# EAGLE design GrblPi B+Industrial (EAGLE 6.4)
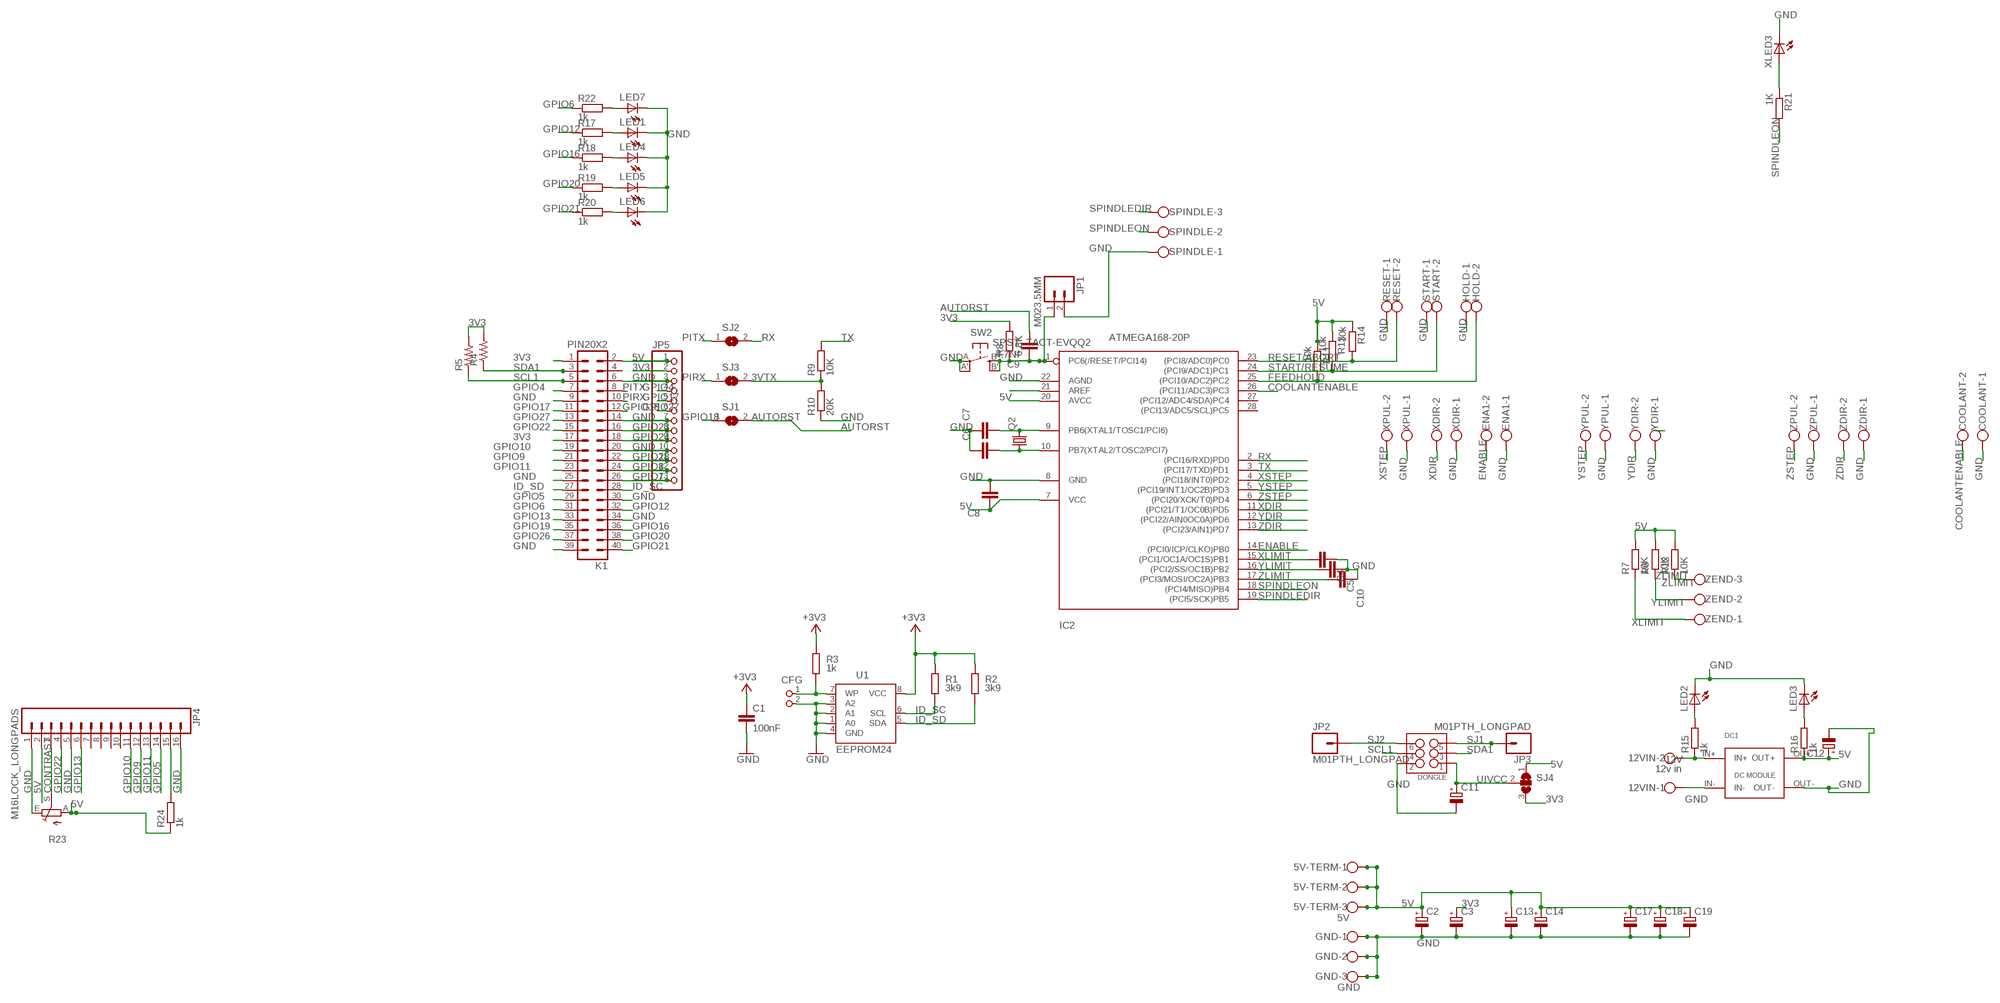
[diagram p0: schematic, sheet 1]

## Parts
5V-TERM  5V  W237-103  [W237-103]
12VIN  12v in  W237-102  [W237-102]
C1  100nF  C-EUC1206  [C1206]
C2  CPOL-EU153CLV-0405  [153CLV-0405]
C3  CPOL-EU153CLV-0405  [153CLV-0405]
C4  CAPACITOR_NPOL-1206  [C1206]
C5  CAPACITOR_NPOL-1206  [C1206]
C6  CAPACITOR_NPOL-1206  [C1206]
C7  CAPACITOR_NPOL-1206  [C1206]
C8  CAPACITOR_NPOL-1206  [C1206]
C9  4.7Nf  CAPACITOR_NPOL-1206  [C1206]
C10  CAPACITOR_NPOL-1206  [C1206]
C11  CPOL-EU153CLV-0405  [153CLV-0405]
C12  CPOL-EU153CLV-0405  [153CLV-0405]
C13  CPOL-EU153CLV-0405  [153CLV-0405]
C14  CPOL-EU153CLV-0405  [153CLV-0405]
C17  CPOL-EU153CLV-0405  [153CLV-0405]
C18  CPOL-EU153CLV-0405  [153CLV-0405]
C19  CPOL-EU153CLV-0405  [153CLV-0405]
CFG  PIN2_100  [PIN_W_2]
COOLANT  W237-102  [W237-102]
DC1  BUCKBOOST  [BUCKBOOST]
DONGLE  M03X2SHROUD  [2X3-SHROUDED]
ENA1  W237-102  [W237-102]
GND  GND  W237-103  [W237-103]
HOLD  W237-102  [W237-102]
IC2  ATMEGA168-20P  [DIL28-3]
JP1  M023.5MM  [SCREWTERMINAL-3.5MM-2]
JP2  M01PTH_LONGPAD  [1X01_LONGPAD]
JP3  M01PTH_LONGPAD  [1X01_LONGPAD]
JP4  M16LOCK_LONGPADS  [1X16_LOCK_LONGPADS]
JP5  PINHD-1X13  [1X13]
K1  PIN20X2  [PIN_20X2]
LED1  LED5MM  [LED5MM]
LED2  LED5MM  [LED5MM]
LED3  LED5MM  [LED5MM]
LED4  LED5MM  [LED5MM]
LED5  LED5MM  [LED5MM]
LED6  LED5MM  [LED5MM]
LED7  LED5MM  [LED5MM]
Q2  CRYSTALHC49UP  [HC49UP]
R1  3k9  R-EU_M1206  [M1206]
R2  3k9  R-EU_M1206  [M1206]
R3  1k  R-EU_M1206  [M1206]
R4  R-US_M1206  [M1206]
R5  R-US_M1206  [M1206]
R6  10K  RESISTOR-1206  [R1206]
R7  10K  RESISTOR-1206  [R1206]
R8  6.8K  RESISTOR-1206  [R1206]
R9  10K  RESISTOR-1206  [R1206]
R10  20K  RESISTOR-1206  [R1206]
R11  10k  RESISTOR-1206  [R1206]
R12  10K  RESISTOR-1206  [R1206]
R13  10k  RESISTOR-1206  [R1206]
R14  10k  RESISTOR-1206  [R1206]
R15  1k  RESISTOR-1206  [R1206]
R16  1k  RESISTOR-1206  [R1206]
R17  1k  RESISTOR-1206  [R1206]
R18  1k  RESISTOR-1206  [R1206]
R19  1k  RESISTOR-1206  [R1206]
R20  1k  RESISTOR-1206  [R1206]
R21  1K  RESISTOR-1206  [R1206]
R22  1k  RESISTOR-1206  [R1206]
R23  TRIM_EU-CA6V  [CA6V]
R24  1k  RESISTOR-1206  [R1206]
RESET  W237-102  [W237-102]
SJ1  SJ  [SJ]
SJ2  SJ  [SJ]
SJ3  SJ  [SJ]
SJ4  SJ2W  [SJ_2]
SPINDLE  W237-103  [W237-103]
START  W237-102  [W237-102]
SW2  SPST_TACT-EVQQ2  [EVQ-Q2]
U1  EEPROM24  [SOIC8]
XDIR  W237-102  [W237-102]
XLED3  LEDCHIPLED_1206  [CHIPLED_1206]
XPUL  W237-102  [W237-102]
YDIR  W237-102  [W237-102]
YPUL  W237-102  [W237-102]
ZDIR  W237-102  [W237-102]
ZEND  W237-103  [W237-103]
ZPUL  W237-102  [W237-102]

## Nets
3V3: C3.+ JP5.2 K1.1 K1.17 R4.2 R5.2 R8.2 SJ4.3
3VTX: R9.1 R10.2 SJ3.2
5V: 5V-TERM.1 5V-TERM.2 5V-TERM.3 C2.+ C8.1 C12.+ C13.+ C14.+ C17.+ C18.+ C19.+ DC1.OU+(OUT+) IC2.7(VCC) IC2.20(AVCC) JP4.2 JP5.1 K1.2 R6.2 R7.2 R11.1 R12.2 R13.1 R14.1 R16.1 R23.A R24.1 SJ4.1
12V: 12VIN.2 DC1.IN+ R15.1
+3V3: C1.1 R1.2 R2.2 R3.2 U1.8(VCC)
AUTORST: C9.2 SJ1.2
CONTRAST: JP4.3 R23.S
COOLANTENABLE: COOLANT.2 IC2.26((PCI11/ADC3)PC3)
ENABLE: ENA1.2 IC2.14((PCI0/ICP/CLKO)PB0)
FEEDHOLD: HOLD.2 IC2.25((PCI10/ADC2)PC2) R11.2
GND: 12VIN.1 C1.2 C2.- C3.- C4.1 C5.1 C6.1 C7.1 C8.2 C10.1 C11.- C12.- C13.- C14.- C17.- C18.- C19.- CFG.2 COOLANT.1 DC1.IN- DC1.OUT- DONGLE.2 ENA1.1 GND.1 GND.2 GND.3 HOLD.1 IC2.8(GND) IC2.22(AGND) JP1.2 JP4.1 JP4.5 JP4.16 JP5.3 JP5.7 JP5.10 K1.6 K1.9 K1.14 K1.20 K1.25 K1.30 K1.34 K1.39 LED1.K(C) LED2.K(C) LED3.K(C) LED4.K(C) LED5.K(C) LED6.K(C) LED7.K(C) R10.1 R23.E RESET.1 SPINDLE.1 START.1 SW2.A'(P1) SW2.A(P) U1.1(A0) U1.2(A1) U1.3(A2) U1.4(GND) XDIR.1 XLED3.C XPUL.1 YDIR.1 YPUL.1 ZDIR.1 ZPUL.1
GPIO4: JP5.4 K1.7
GPIO5: JP4.14 K1.29
GPIO6: K1.31 R22.1
GPIO7: JP5.13 K1.26
GPIO8: JP5.12 K1.24
GPIO9: JP4.12 K1.21
GPIO10: JP4.11 K1.19
GPIO11: JP4.13 K1.23
GPIO12: K1.32 R17.1
GPIO13: JP4.6 K1.33
GPIO16: K1.36 R18.1
GPIO17: JP5.5 K1.11
GPIO18: K1.12 SJ1.1
GPIO19: K1.35
GPIO20: K1.38 R19.1
GPIO21: K1.40 R20.1
GPIO22: JP4.4 K1.15
GPIO23: JP5.8 K1.16
GPIO24: JP5.9 K1.18
GPIO26: K1.37
GPIO27: JP5.6 K1.13
GPIO28: JP5.11 K1.22
ID_SC: K1.28 R1.1 U1.6(SCL)
ID_SD: K1.27 R2.1 U1.5(SDA)
LED: JP4.15 R24.2
MCURESET1: C9.1 IC2.1(PC6(/RESET/PCI14)) JP1.1 R8.1 SW2.B'(S1) SW2.B(S)
N$3: CFG.1 R3.1 U1.7(WP)
N$5: LED2.A R15.2
N$6: LED3.A R16.2
N$7: LED1.A R17.2
N$8: LED4.A R18.2
N$9: LED5.A R19.2
N$10: LED6.A R20.2
N$11: LED7.A R22.2
N$13: IC2.21(AREF)
PIRX: K1.10 SJ3.1
PITX: K1.8 SJ2.1
RESET/ABORT: IC2.23((PCI8/ADC0)PC0) R14.2 RESET.2
RX: IC2.2((PCI16/RXD)PD0) SJ2.2
SCL1: DONGLE.4 K1.5 R5.1
SDA1: DONGLE.3 K1.3 R4.1
SJ1: DONGLE.5 JP3.1
SJ2: DONGLE.6 JP2.1
SPINDLEDIR: IC2.19((PCI5/SCK)PB5) SPINDLE.3
SPINDLEON: IC2.18((PCI4/MISO)PB4) R21.2 SPINDLE.2
START/RESUME: IC2.24((PCI9/ADC1)PC1) R13.2 START.2
TX: IC2.3((PCI17/TXD)PD1) R9.2
UIVCC: C11.+ DONGLE.1 SJ4.2
XDIR: IC2.11((PCI21/T1/OC0B)PD5) XDIR.2
XLIMIT: C4.2 IC2.15((PCI1/OC1A/OC1S)PB1) R7.1 ZEND.1
XSTEP: IC2.4((PCI18/INT0)PD2) XPUL.2
XTAL3: C6.2 IC2.10(PB7(XTAL2/TOSC2/PCI7)) Q2.1
XTAL4: C7.2 IC2.9(PB6(XTAL1/TOSC1/PCI6)) Q2.2
YDIR: IC2.12((PCI22/AIN0OC0A)PD6) YDIR.2
YLIMIT: C5.2 IC2.16((PCI2/SS/OC1B)PB2) R6.1 ZEND.2
YSTEP: IC2.5((PCI19/INT1/OC2B)PD3) YPUL.2
ZDIR: IC2.13((PCI23/AIN1)PD7) ZDIR.2
ZLED3: R21.1 XLED3.A
ZLIMIT: C10.2 IC2.17((PCI3/MOSI/OC2A)PB3) R12.1 ZEND.3
ZSTEP: IC2.6((PCI20/XCK/T0)PD4) ZPUL.2
Unconnected: IC2.27((PCI12/ADC4/SDA)PC4) IC2.28((PCI13/ADC5/SCL)PC5) JP4.7 JP4.8 JP4.9 JP4.10 K1.4

## Library data of the parts
5V-TERM GND SPINDLE ZEND = con-wago-500:W237-103: WAGO SCREW CLAMP; MPN: 237-103; OC_FARNELL: unknown; OC_NEWARK: 18M7116
12VIN COOLANT ENA1 HOLD RESET START XDIR XPUL YDIR YPUL ZDIR ZPUL = con-wago-500:W237-102: WAGO SCREW CLAMP; MPN: 237-102; OC_FARNELL: unknown; OC_NEWARK: 70K9898
C1 = resistor:C-EU: CAPACITOR, European symbol; DIELECTRIC: X7R
C2 C3 C11-C14 C17-C19 = rcl:CPOL-EU: POLARIZED CAPACITOR, European symbol
C4-C10 = dp_devices:CAPACITOR_NPOL: Non-Polarized capacitor in various packages
CFG = FLYFISH:PIN2
DC1 = OpenHardware.co.za:BUCKBOOST: Ebay-style LM2596 Buck/Boost Switchmode Convert modules
DONGLE = SparkFun-Connectors:M03X2: 2x3 .1" header. Shrouded, with keying- CONN-10681 SMT- CONN-11415 Pogo pins- HW-11044; PROD_ID: CONN-10681
IC2 = adafruit:ATMEGA168*P: MICROCONTROLLER 16 kBytes FLASH 1 kBytes SRAM 512 Bytes EEPROM USART 8-channel 10 bit ADC
JP1 = SparkFun-Connectors:M02: Standard 2-pin 0.1" header. Use with - straight break away headers ( PRT-00116) - right angle break away headers (PRT-00553) - swiss pins (PRT-00743) - machine pins (PRT-00117) - female headers (PRT-00115) Molex polarized connector foot print use with: PRT-08233 with associated crimp pins and housings. 2.54_SCREWTERM for use with PRT-10571. 3.5mm Screw Terminal footprints for PRT-08084 5mm Screw Terminal footprints for use with PRT-08433
JP2 JP3 = SparkFun-Connectors:M01: Header 1 Standard 1-pin 0.1" header. Use with straight break away headers (SKU : PRT-00116), right angle break away headers (PRT-00553), swiss pins (PRT-00743), machine pins (PRT-00117), and female headers (PRT-00115).
JP4 = SparkFun-Connectors:M16: 1x16 .1" header
JP5 = adafruit:PINHD-1X13: PIN HEADER
K1 = FLYFISH:PIN20X2
LED1-LED7 XLED3 = adafruit:LED: LED OSRAM: - CHIPLED LG R971, LG N971, LY N971, LG Q971, LY Q971, LO R971, LY R971 LH N974, LH R974 LS Q976, LO Q976, LY Q976 LO Q996 - Hyper CHIPLED LW Q18S LB Q993, LB Q99A, LB R99A - SideLED LS A670, LO A670, LY A670, LG A670, LP A670 LB A673, LV A673, LT A673, LW A673 LH A674 LY A675 LS A676, LA A676, LO A676, LY A676, LW A676 LS A679, LY A679, LG A679 - Hyper Micro SIDELED® LS Y876, LA Y876, LO Y876, LY Y876 LT Y87S - SmartLED LW L88C, LW L88S LB L89C, LB L89S, LG L890 LS L89K, LO L89K, LY L89K LS L896, LA L896, LO L896, LY L896 - TOPLED LS T670, LO T670, LY T670, LG T670, LP T670 LSG T670, LSP T670, LSY T670, LOP T670, LYG T670 LG T671, LOG T671, LSG T671 LB T673, LV T673, LT T673, LW T673 LH T674 LS T676, LA T676, LO T676, LY T676, LB T676, LH T676, LSB T676, LW T676 LB T67C, LV T67C, LT T67C, LS T67K, LO T67K, LY T67K, LW E67C LS E67B, LA E67B, LO E67B, LY E67B, LB E67C, LV E67C, LT E67C LW T67C LS T679, LY T679, LG T679 LS T770, LO T770, LY T770, LG T770, LP T770 LB T773, LV T773, LT T773, LW T773 LH T774 LS E675, LA E675, LY E675, LS T675 LS T776, LA T776, LO T776, LY T776, LB T776 LHGB T686 LT T68C, LB T68C - Hyper Mini TOPLED® LB M676 - Mini TOPLED Santana® LG M470 LS M47K, LO M47K, LY M47K Source: http://www.osram.convergy.de/
Q2 = adafruit:CRYSTAL: CRYSTAL; OC_FARNELL: unknown; OC_NEWARK: unknown
R1-R3 = resistor:R-EU_: RESISTOR, European symbol; TOLERANCE: 5%
R4 R5 = adafruit:R-US_: RESISTOR, American symbol
R6-R22 R24 = dp_devices:RESISTOR
R23 = pot:TRIM_EU-: POTENTIOMETER
SJ1-SJ3 = jumper:SJ: SMD solder JUMPER
SJ4 = jumper:SJ2W: SMD solder JUMPER
SW2 = adafruit:SPST_TACT: SMT 6mm switch, EVQQ2 series http://www.ladyada.net/library/eagle
U1 = FLYFISH:EEPROM24

## Board
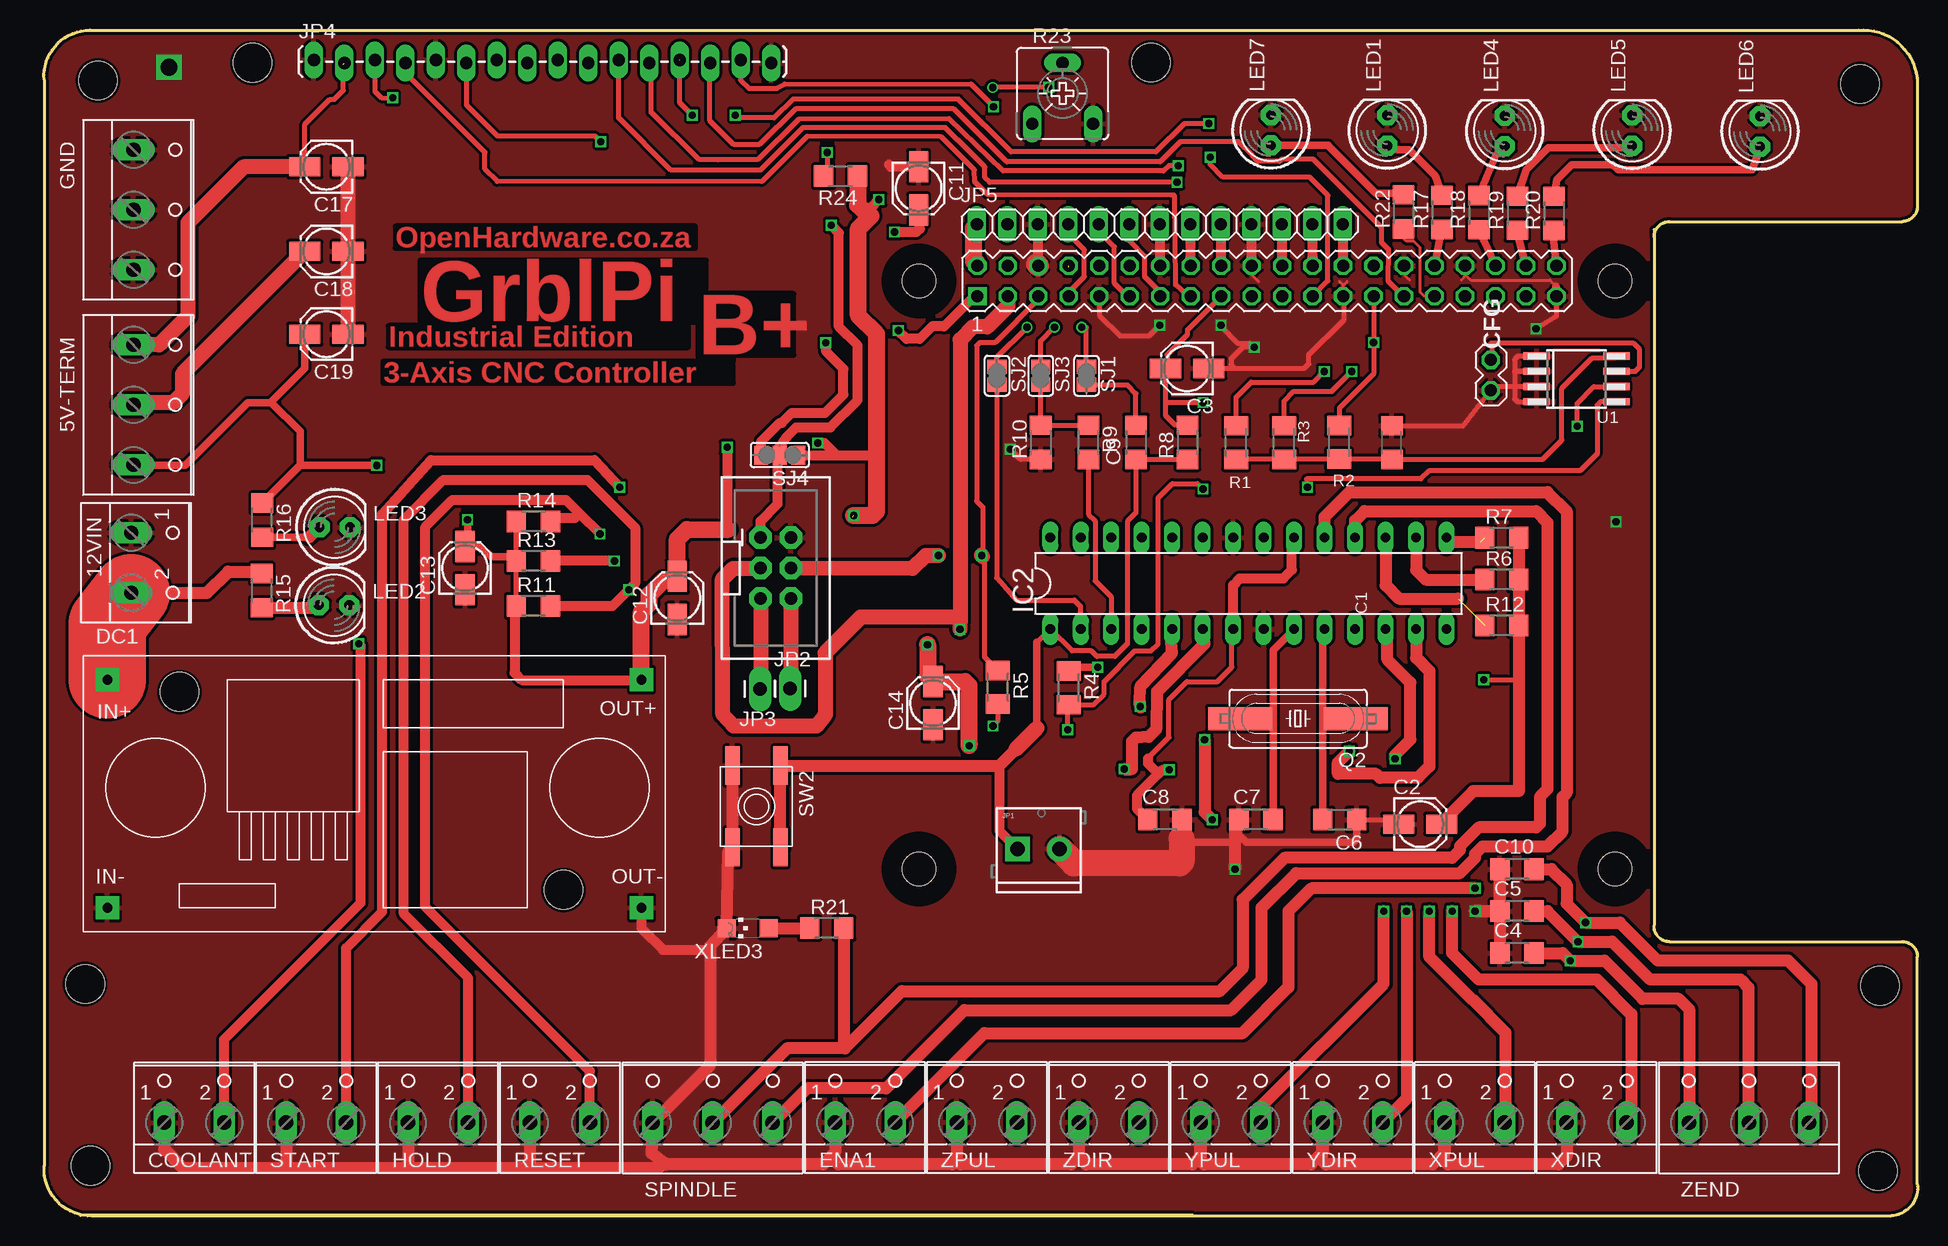
[diagram p1: board, top side]
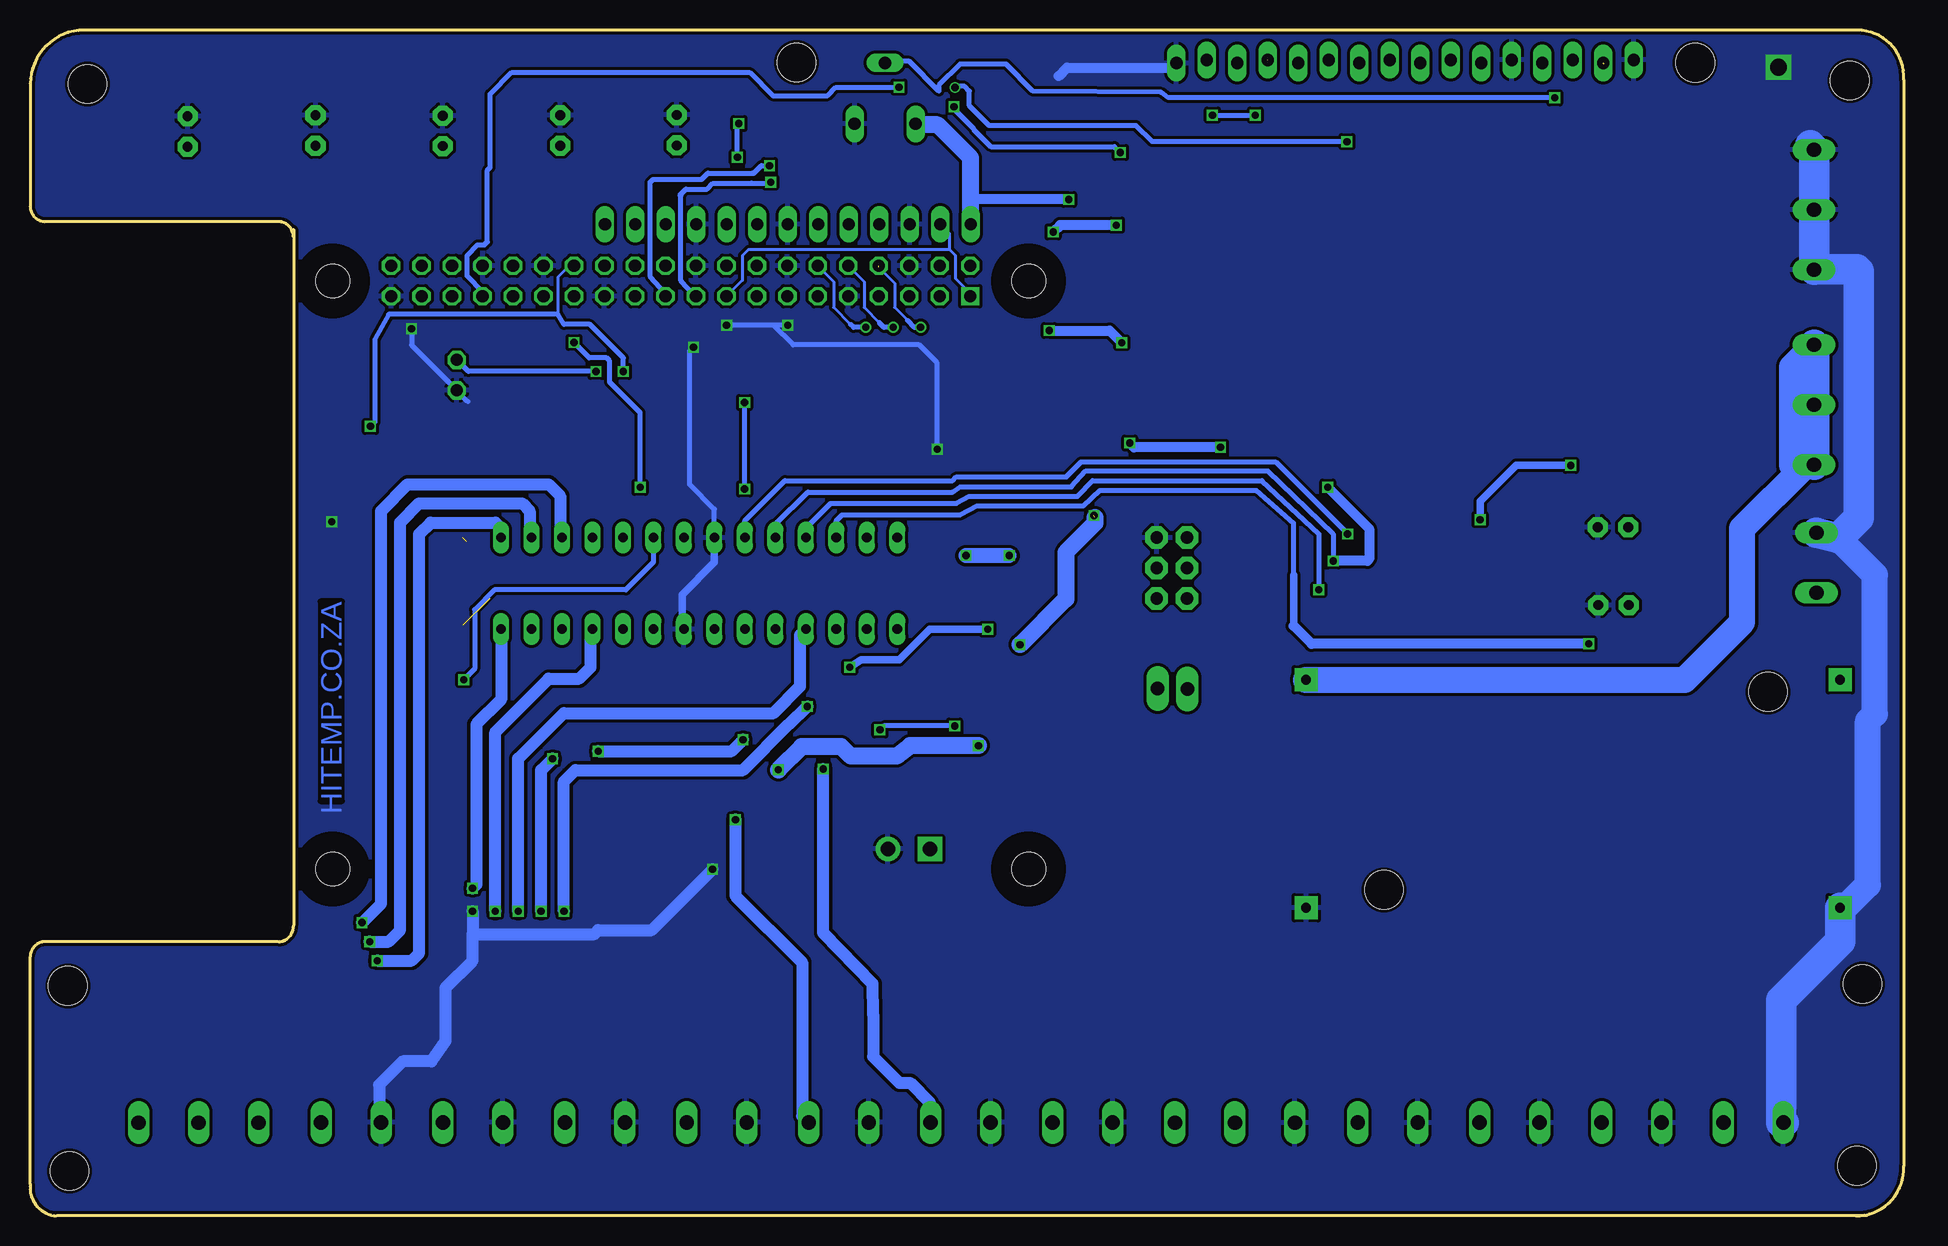
[diagram p2: board, bottom side, seen from below]

Size 156.14 x 98.83 mm. Coordinates in mm from the lower left corner, seen from the top.
Outline: 0.01,94.69 0.01,4.15 arc94 4.02,0 153.93,0 arc94 156.12,2.66
Outline: 156.12,2.64 156.12,21.59 arc90 154.85,22.86 135.46,22.86 arc-90 134.19,24.13
Outline: 134.18,82.22 134.18,24.22
Outline: 134.19,81.6 arc-90 135.46,82.87 154.85,82.87 arc90 156.12,84.14 156.12,94.37 arc94 151.21,98.81 3.84,98.81 arc94 0.01,94.7
Outline: 95.76,0.05 3.05,0.05
Copper layers (1*16): Top 0.035mm / dielectric 1.5mm / Bottom 0.035mm
Design rules "dirt_cheap_dirty_boards.v1 *": minimum track width 5mil, minimum drill 12mil, track to track 10mil, track to pad 10mil, pad to pad 10mil, via to via 10mil, smd to smd 10mil, copper to edge 10mil, drill to drill 10mil, minimum pad ring 10mil, minimum via ring 6mil, stop-mask expansion 2mil, vias tented up to drill 25mil, thermal gap 10mil
Holes 2.8 mm at 72.92,28.91 72.92,77.91 130.92,77.91 130.92,28.91
Holes 3.2 mm at 3.89,4.18 152.84,3.73 152.99,19.18 3.44,19.33 4.49,94.63 151.34,94.33 17.37,96.1 92.27,96.11
tRestrict: area 71.4,76.4 to 74.5,79.5; area 129.4,76.4 to 132.5,79.5; area 129.4,27.4 to 132.5,30.5; area 71.4,27.4 to 74.5,30.5
bRestrict: area 71.4,27.4 to 74.5,30.5; area 71.4,76.4 to 74.5,79.5; area 129.4,27.4 to 132.5,30.5; area 129.4,76.4 to 132.5,79.5

### Footprints (pad centres in the part's own frame; a part is rotated, then mirrored left to right if it is on the bottom)
W237-103 = drill 1.194 long: 1 -5,-1.29; 2 0,-1.29; 3 5,-1.29
W237-102 = drill 1.194 long: 1 -2.5,-1.27; 2 2.5,-1.27
C1206 = smd 1.6 x 1.8: 1 -1.4,0; 2 1.4,0
153CLV-0405 = smd 2.6 x 1.6: + 1.8,0; - -1.8,0
C1206' = smd 1.6 x 1.803: 1 -1.422,0; 2 1.422,0
PIN_W_2 = drill 1.016 octagon: 1 0,0; 2 0,-2.54
BUCKBOOST = drill 0.8 pad 1.93 square: IN+ 2,21; IN- 2,2; OU+ 46.5,21; OUT- 46.5,2 | hole 3.2: 8,20; 40,3.5
2X3-SHROUDED = drill 1.016 pad 1.88 octagon: 1 -1.27,2.54; 2 1.27,2.54; 3 -1.27,0; 4 1.27,0; 5 -1.27,-2.54; 6 1.27,-2.54
DIL28-3 = drill 0.813 long: 1 -16.51,-3.81; 2 -13.97,-3.81; 3 -11.43,-3.81; 4 -8.89,-3.81; 5 -6.35,-3.81; 6 -3.81,-3.81; 7 -1.27,-3.81; 8 1.27,-3.81; 9 3.81,-3.81; 10 6.35,-3.81; 11 8.89,-3.81; 12 11.43,-3.81; 13 13.97,-3.81; 14 16.51,-3.81; 15 16.51,3.81; 16 13.97,3.81; 17 11.43,3.81; 18 8.89,3.81; 19 6.35,3.81; 20 3.81,3.81; 21 1.27,3.81; 22 -1.27,3.81; 23 -3.81,3.81; 24 -6.35,3.81; 25 -8.89,3.81; 26 -11.43,3.81; 27 -13.97,3.81; 28 -16.51,3.81
SCREWTERMINAL-3.5MM-2 = drill 1.2 pad 2.032 square: 1 0,0 | drill 1.2 pad 2.032: 2 3.5,0
1X01_LONGPAD = drill 1.118 pad 1.88 long: 1 0,0
1X16_LOCK_LONGPADS = drill 1.016 long: 1 0,0.127; 2 2.54,-0.127; 3 5.08,0.127; 4 7.62,-0.127; 5 10.16,0.127; 6 12.7,-0.127; 7 15.24,0.127; 8 17.78,-0.127; 9 20.32,0.127; 10 22.86,-0.127; 11 25.4,0.127; 12 27.94,-0.127; 13 30.48,0.127; 14 33.02,-0.127; 15 35.56,0.127; 16 38.1,-0.127
1X13 = drill 1.016 long: 1 -15.24,0; 2 -12.7,0; 3 -10.16,0; 4 -7.62,0; 5 -5.08,0; 6 -2.54,0; 7 0,0; 8 2.54,0; 9 5.08,0; 10 7.62,0; 11 10.16,0; 12 12.7,0; 13 15.24,0
PIN_20X2 = drill 1.016 square: 1 -24.13,-1.27 | drill 1.016 octagon: 2 -24.13,1.27; 3 -21.59,-1.27; 4 -21.59,1.27; 5 -19.05,-1.27; 6 -19.05,1.27; 7 -16.51,-1.27; 8 -16.51,1.27; 9 -13.97,-1.27; 10 -13.97,1.27; 11 -11.43,-1.27; 12 -11.43,1.27; 13 -8.89,-1.27; 14 -8.89,1.27; 15 -6.35,-1.27; 16 -6.35,1.27; 17 -3.81,-1.27; 18 -3.81,1.27; 19 -1.27,-1.27; 20 -1.27,1.27; 21 1.27,-1.27; 22 1.27,1.27; 23 3.81,-1.27; 24 3.81,1.27; 25 6.35,-1.27; 26 6.35,1.27; 27 8.89,-1.27; 28 8.89,1.27; 29 11.43,-1.27; 30 11.43,1.27; 31 13.97,-1.27; 32 13.97,1.27; 33 16.51,-1.27; 34 16.51,1.27; 35 19.05,-1.27; 36 19.05,1.27; 37 21.59,-1.27; 38 21.59,1.27; 39 24.13,-1.27; 40 24.13,1.27
LED5MM = drill 0.813 pad 1.676 octagon: A -1.27,0; K 1.27,0
HC49UP = smd 5.334 x 1.93: 1 -4.826,0; 2 4.826,0
M1206 = smd 1.6 x 2: 1 -1.4,0; 2 1.4,0
R1206 = smd 1.6 x 1.803: 1 -1.422,0; 2 1.422,0
CA6V = drill 1.016 long: A -2.54,-2.54; E 2.54,-2.54; S 0,2.54
SJ = smd 1.168 x 1.6: 1 -0.762,0; 2 0.762,0
SJ_2 = smd 1.168 x 1.6: 1 -1.524,0; 2 0,0; 3 1.524,0
EVQ-Q2 = smd 3.2 x 1.2: A -3.4,-2; A' 3.4,-2; B -3.4,2; B' 3.4,2
SOIC8 = smd 0.6 x 2.2: 1 -1.905,-3.33; 2 -0.635,-3.33; 3 0.635,-3.33; 4 1.905,-3.33; 5 1.905,3.33; 6 0.635,3.33; 7 -0.635,3.33; 8 -1.905,3.33
CHIPLED_1206 = smd 1.5 x 1.5: A 0,-1.75; C 0,1.75

### Placement (x,y rotation side)
5V-TERM  8.75,67.59 270 top
12VIN  8.54,54.43 270 top
C1  112.32,64.44 90 top
C2  114.69,32.65 0 top
C3  95.26,70.62 180 top
C4  [C1206']  122.76,21.91 0 top
C5  [C1206']  122.76,25.4 0 top
C6  [C1206']  107.99,33.03 180 top
C7  [C1206']  101.01,33.03 0 top
C8  [C1206']  93.42,33.03 0 top
C9  4.7Nf  [C1206']  91.01,64.47 90 top
C10  [C1206']  122.76,28.89 0 top
C11  72.89,85.63 270 top
C12  52.78,51.5 90 top
C13  35.09,53.98 90 top
C14  74.09,42.73 90 top
C17  23.54,87.43 180 top
C18  23.54,80.38 180 top
C19  23.54,73.48 180 top
CFG  120.58,71.34 0 top
COOLANT  12.52,9.05 0 top
DC1  3.29,23.68 0 top
DONGLE  60.99,54 0 top
ENA1  68.43,9.06 0 top
GND  8.75,83.85 270 top
HOLD  32.84,9.05 0 top
IC2  100.37,52.72 0 top
JP1  81.14,30.58 0 top
JP2  62.18,43.95 0 top
JP3  59.68,43.91 180 top
JP4  22.51,96.2 0 top
JP5  92.99,82.63 0 top
K1  101.92,77.91 0 top
LED1  111.95,90.46 90 top
LED2  24.17,50.9 0 top
LED3  24.23,57.4 0 top
LED4  121.74,90.42 90 top
LED5  132.34,90.44 90 top
LED6  143.01,90.38 90 top
LED7  102.25,90.48 90 top
Q2  104.5,41.45 180 top
R1  99.34,64.45 270 top
R2  107.93,64.47 270 top
R3  103.34,64.45 270 top
R4  85.39,44.01 270 top
R5  79.49,44.06 270 top
R6  121.49,53.02 0 top
R7  121.49,56.52 0 top
R8  95.29,64.47 90 top
R9  87.04,64.47 270 top
R10  83.07,64.47 90 top
R11  40.79,50.83 0 top
R12  121.49,49.21 0 top
R13  40.79,54.58 0 top
R14  40.79,57.88 0 top
R15  18.16,52.11 270 top
R16  18.19,57.99 270 top
R17  116.52,83.63 90 top
R18  119.58,83.61 90 top
R19  122.79,83.55 90 top
R20  125.85,83.54 90 top
R21  65.24,23.98 0 top
R22  113.31,83.67 90 top
R23  84.89,93.54 0 top
R24  66.38,86.65 180 top
RESET  43,9.05 0 top
SJ1  86.88,70.02 270 top
SJ2  79.42,70.02 270 top
SJ3  83.07,70.02 270 top
SJ4  61.32,63.4 180 top
SPINDLE  55.73,9.06 0 top
START  22.68,9.05 0 top
SW2  59.38,34.12 270 top
U1  127.72,69.75 270 top
XDIR  129.39,9.06 0 top
XLED3  58.64,23.98 90 top
XPUL  119.23,9.06 0 top
YDIR  109.07,9.06 0 top
YPUL  98.91,9.06 0 top
ZDIR  88.75,9.06 0 top
ZEND  142.09,9.06 0 top
ZPUL  78.59,9.06 0 top

### Tracks (layer width: path | path; a pad name or v marks a point on that pad's centre or on a via)
3V3  (via drill 0.6, 0.6 pad 0.41)
  Top 0.406: K1.17 95.29,73.83 95.29,73.45 93.61,71.77 93.61,70.77 C3.+ 93.46,67.78 | 93.46,67.78 93.46,66.71 94.24,65.93 95.25,65.93 R8.2 | v85.31,40.5 85.31,42.53 R4.2 87.46,42.61 88.34,43.48 88.34,44.53 90.89,47.08 92.24,47.08 92.84,47.68 92.84,59.83 94.04,61.03 96.14,61.03 v96.59,60.58 | R5.2 79.49,41.23 v79.08,40.83 | v96.59,67.78 93.46,67.78
  Top 0.813: SJ4.3 59.79,64.56 61.32,66.09 61.5,66.09 62.33,66.93 65.1,66.93 66.62,68.45 66.62,70.59 | 66.62,70.59 66.61,70.54 | K1.1 77.51,76.64 75.01,74.14 74.01,74.14 72.96,73.09 71.9,73.09 v71.21,73.78 | v65.16,72.77 65.16,72.06 66.62,70.59
  Bottom 0.254: K1.1 77.79,76.9 79,78.12 79,80.02 79.51,80.53 | 79.51,80.53 96.28,80.53 96.78,80.02 96.78,77.96 K1.17 | 79.51,80.53 79.51,81.84 arc-45 79.52,81.86 JP5.2
  Bottom 0.406: 79.23,40.88 78.96,40.83 v79.08,40.83 84.99,40.83 v85.31,40.5 | v96.59,60.58 v96.59,67.78
  Bottom 0.813: v71.21,73.78 66.17,73.78 v65.16,72.77
3VTX
  Top 0.406: SJ3.2 R10.2 R9.1
5V  (via drill 0.6, 0.6 pad 0.41)  (2 unrouted)
  Top 0.406: 92,38.14 93.74,39.88 93.74,43.03 95.24,44.53 97.79,44.53 98.99,45.73 98.99,48.8 IC2.7 | v119.99,44.68 122.61,44.68 122.91,44.38 | 39.22,50.98 R11.1 R13.1 R14.1 | C17.+ 21.74,90.96 23.82,93.04 24.2,93.04 24.96,93.8 24.96,95.99
  Top 0.61: 18.88,67.78 18.95,67.78 21.35,65.38 21.35,62.57 R16.1 21.31,62.54 v27.74,62.54 | v35.3,58.03 35.3,55.99 C13.+ 36.42,55.78 37.28,54.92 39.03,54.92 R13.1 | C19.+ 21.74,70.64 18.88,67.78 | 18.88,67.78 16.99,67.78 11.78,62.57 7.48,62.57 5V-TERM.3
  Top 0.813: 77.45,82.33 JP5.1 | v93.78,37.18 93.21,37.18 92.87,36.84 | 92.87,36.84 91.07,35.04 91.07,33.96 C8.1 | 92,38.14 92,37.71 92.87,36.84 | IC2.7 99.1,52.58 99.65,53.12 103.28,53.12 104,53.83 104,56.34 IC2.20 | SJ4.1 66.06,63.4 | 66.06,63.4 69.15,63.4 69.39,63.16 | 56.98,57.2 56.98,64.01 v56.93,64.05 | v64.49,64.41 65.05,64.41 66.06,63.4 | 68.93,83.34 68.93,84.07 v69.58,84.71 | 39.22,50.98 39.22,45.25 39.82,44.65 49.93,44.65 49.98,44.7
  Top 1.016: R7.2 R6.2 R12.2 122.91,44.38 122.91,35.39 119.1,35.39 116.41,32.7 116.54,32.7 C2.+
  Top 1.27: K1.2 77.79,79.54 | C17.+ 16.64,87.43 11.99,82.78 11.99,74.98 9.59,72.58 7.47,72.58 5V-TERM.1 | C18.+ 11.54,70.18 11.54,68.53 10.79,67.78 7.65,67.78 5V-TERM.2
  Top 1.422: 56.98,57.2 53.6,57.22 52.78,56.39 C12.+ 52.45,52.97 51.64,52.97 50.44,51.77 50.44,51.01 49.79,50.35 DC1.OU+ | v73.64,47.61 73.64,44.99 C14.+ 76.77,44.53 77.08,44.22 77.08,39.52 v77.1,39.18 | v67.48,58.37 69.05,58.37 69.39,58.71 69.39,63.16 69.39,73.51 67.87,75.04 67.87,82.28 68.93,83.34 68.72,83.34 67.81,84.26 R24.1 | 77.45,82.33 77.45,79.52 K1.2
  Bottom 0.406: IC2.20 104.18,54.49 106.49,52.18 117.44,52.18 119.09,50.53 119.09,45.58 v119.99,44.68
  Bottom 0.61: v27.74,62.54 32.29,62.54 35.27,59.57 35.27,58.06 v35.3,58.03
  Bottom 0.813: v56.93,64.05 64.14,64.05 v64.49,64.41 | v69.58,84.71 77.67,84.71 77.75,84.79
  Bottom 1.422: 67.4,58.21 67.4,57.73 69.82,55.31 69.82,51.43 v73.64,47.61 | JP5.1 77.75,84.79 77.75,88.17 80.51,90.93 82.27,90.93 R23.A | v77.1,39.18 82.8,39.18 83.92,38.32 87.74,38.32 88.54,39.12 91.84,39.12 v93.78,37.18
  Bottom 2.184: DC1.OU+ 18.25,44.68 13.45,49.48 13.45,57.29 8.17,62.57 9.29,62.57 9.29,70.77 5V-TERM.1
  Bottom 2.54: 5V-TERM.1 5V-TERM.2 | 5V-TERM.2 7.46,67.51 7.79,67.18 | 7.79,67.18 7.79,67.26 5V-TERM.2 | 5V-TERM.3 7.46,66.85 7.79,67.18
12V
  Top 1.016: 12VIN.2 13.58,51.93 15.35,53.7 17.98,53.7 R15.1
  Top 6.452: DC1.IN+ 5.29,49.35 12VIN.2
+3V3
  Top 0.406: R1.2 R3.2 103.37,63.07 R2.2 107.96,63.04 C1.1 124.89,63.04 126.5,64.66 126.5,68.97 129.04,71.51 130.91,71.51 U1.8
AUTORST
  Top 0.406: C9.2 91.01,68.53 90.31,69.23 86.91,69.23 SJ1.2
CONTRAST  (via drill 0.6 pad 0.41)
  Top 0.406: JP4.3 27.58,93.71 28.11,93.18 28.71,93.16 v29.07,93.17
  Bottom 0.406: v29.07,93.17 61.27,93.19 61.88,93.63 72.57,93.74 74.81,95.98 78.63,95.98 80.39,94.21 80.39,93.74 82.86,96.21 84.76,96.21 R23.S
COOLANTENABLE  (via drill 0.6 pad 0.41)
  Top 0.813: COOLANT.2 15.02,14.71 26.39,26.08 26.39,47.53 v26.24,47.68
  Bottom 0.406: IC2.26 88.94,57.94 88.47,58.42 78.62,58.42 77.2,59.18 68.38,59.18 66.99,60.47 53.94,60.47 50.84,57.73 50.84,53.38
  Bottom 0.61: 50.84,49.18 50.84,53.38
  Bottom 0.813: v26.24,47.68 49.34,47.68 50.84,49.18
ENABLE  (via drill 0.6)
  Top 1.016: v119.26,27.3 105.61,27.3 103.71,25.4 103.71,19.05 99.9,15.24 78.38,15.24 ENA1.2
  Bottom 1.016: IC2.14 116.88,43.02 118.95,40.96 118.95,27.62 v119.26,27.3
FEEDHOLD  (via drill 0.6 pad 0.41)
  Top 0.406: v48.74,52.18 48.74,52.03 47.54,50.83
  Top 0.813: HOLD.2 35.34,19.83 29.99,25.18 29.99,58.03 33.29,61.33 45.29,61.33 49.27,57.36 49.27,52.71 v48.74,52.18 47.39,50.83 R11.2
  Bottom 0.406: IC2.25 91.48,57.31 89.42,59.37 78.94,59.37 77.89,59.97 68.85,59.97 67.59,61.28 53.49,61.28 48.74,56.83 v48.74,52.18
GND  (via drill 0.6, 1.4 pad 0.41)
  Top 0.254: K1.20 100.65,78.45 101.23,77.86 | 107.96,77.86 108.21,77.61 108.21,76.69 K1.25 108.27,77.53 108.59,77.86 | K1.30 113.35,78.45 113.8,77.99 | 118.12,77.99 118.5,78.37 118.5,79.11 K1.34 118.43,78.45 118.88,77.99 125.49,77.99 125.99,77.48
  Top 0.406: 122.57,69.12 U1.3 122.96,69.12 122.57,69.1 122.57,68.08 122.82,67.83 124.38,67.83 U1.4 | 122.57,69.12 120.89,69.12 CFG.2 118.26,65.84 C1.2 | U1.1 122.83,71.65 122.57,71.39 122.57,70.37 | 122.57,70.37 124.38,70.37 U1.2 122.96,70.39 122.57,70.37 | 122.57,70.37 122.57,69.12 | K1.39 126.05,74.99 v124.34,73.93 | C3.- 99.26,70.62 | 99.26,70.62 105.04,70.62 105.42,71.01 105.42,71.77 108.34,74.69 108.34,76.57 K1.25 | C6.1 112.51,33.03 C2.- | v100.85,72.39 99.9,72.39 98.94,71.44 98.94,70.94 99.26,70.62 | K1.9 87.95,75.08 89.69,73.33 92.09,73.33 v92.99,74.23 | v98.09,74.23 98.09,74.08 99.44,72.73 100.49,72.73 100.79,72.43 | R10.1 81.38,63.04 v80.54,63.88
  Top 0.61: C6.1 109.41,31.44 109.1,31.13 100.21,31.13 99.58,31.76 C7.1 99.58,31.77 98.94,31.13 95.13,31.13 94.82,31.45 94.82,33.01 C8.2 | K1.39 126.05,77.43 125.99,77.48
  Top 0.813: DC1.OUT- 49.79,23.98 51.59,22.18 55.38,22.18 55.53,22.33 | JP5.7 92.99,79.22 K1.14 | JP5.10 100.61,79.22 K1.20 | JP5.3 82.83,79.22 K1.6 | C11.- 70.6,87.43 70.42,87.6
  Top 1.016: 76.05,4.61 76.09,4.65 ZPUL.1 | XDIR.1 126.89,4.97 126.21,4.29 117,4.29 116.69,4.61 116.69,7.75 XPUL.1 116.73,5.29 115.73,4.29 106.84,4.29 106.53,4.61 106.53,7.75 YDIR.1 106.57,5.29 105.57,4.29 96.68,4.29 96.37,4.61 96.37,7.75 YPUL.1 96.41,4.97 95.73,4.29 86.84,4.29 86.25,4.89 ZDIR.1 86.25,4.97 85.57,4.29 76.36,4.29 76.05,4.61 | 76.05,4.61 75.73,4.29 66.2,4.29 65.89,4.61 | 65.89,7.75 ENA1.1 65.93,5.29 64.93,4.29 51.86,4.29 51.67,4.44 | 51.67,4.44 50.65,5.21 50.8,7.54 SPINDLE.1 | 50.5,7.24 SPINDLE.1 | C5.1 v119.26,25.4 121.49,25.4 121.33,25.55 C10.1 C5.1 | C5.1 C4.1 | v99.26,28.89 99.26,32.71 C7.1 | 57.44,37.59 SW2.A SW2.A' 57.04,30.39 XLED3.C 55.53,22.47 55.53,22.33 55.53,12.57 SPINDLE.1 | COOLANT.1 10.02,5.55 11.54,4.03 20.09,4.03 | 20.09,4.03 30.59,4.03 | 30.59,4.03 40.64,4.03 | 40.64,4.03 51.26,4.03 51.67,4.44 | START.1 20.18,4.12 20.09,4.03 | HOLD.1 30.34,4.28 30.59,4.03 | RESET.1 40.5,4.17 40.64,4.03
  Top 1.27: C19.- C18.- C17.-
  Top 1.778: 82.75,79.3 K1.6
  Top 2.184: 94.82,31.45 94.82,29.56 94.64,29.38 85.84,29.38 JP1.2
  Bottom 0.406: 119.64,67.86 CFG.2 124.34,72.56 v124.34,73.93 | IC2.22 99.1,58.9 101.17,60.96 101.17,72.07 v100.85,72.39 | v92.99,74.23 94.19,74.23 | 94.19,74.23 v98.09,74.23 | v80.54,63.88 80.54,71.08 82.04,72.58 92.54,72.58 94.19,74.23
  Bottom 0.61: IC2.22 99.1,54.46 101.8,51.77 101.8,49.07 IC2.8
  Bottom 0.813: 70.42,94.99 69.73,95.68 61,95.68 JP4.16
  Bottom 1.016: 119.26,23.49 119.26,21.27 121.53,19.01 121.53,14.57 122.69,12.88 125.09,12.88 127.04,10.93 127.04,7.94 XDIR.1 | v119.26,25.4 119.26,23.49 | 119.26,23.49 109.1,23.49 108.79,23.81 104.34,23.81 v99.26,28.89
  Bottom 2.184: DC1.IN- 4.89,25.68 2.99,27.58 2.99,41.23 2.39,41.83 2.39,53.43 5.44,56.48
  Bottom 2.54: 12VIN.1 5.44,56.48 3.74,58.18 3.74,78.73 3.89,78.88 7.43,78.88 GND.3 GND.2 GND.1 | GND.1 7.46,88.9 7.79,89.23 7.79,89.18 GND.1 | DC1.IN- 5.29,22.88 10.19,17.98 10.19,7.78 COOLANT.1
  other vias: 10.43,95.73 131.01,57.86
  pour Top: -7.81,101.08 155.39,101.08 159.89,96.58 159.89,82.63 156.59,79.33 139.79,79.33 137.24,76.78 137.24,27.88 139.04,26.08 157.04,26.08 159.59,23.53 159.59,-0.17 155.84,-3.92 -0.16,-3.92 -5.86,1.78 -5.86,99.13
  pour Bottom: -3.16,102.58 150.84,101.72 160.19,98.38 160.19,81.88 157.79,79.48 138.89,79.48 137.09,77.68 137.09,26.08 137.99,25.18 156.29,25.18 158.69,22.78 158.69,0.13 155.09,-3.47 -2.11,-3.47 -5.86,0.28 -5.86,99.88
GPIO4
  Top 0.406: K1.7 85.41,76.98 86.7,78.28 86.7,80.51 85.3,81.91 85.3,82.57 JP5.4
GPIO5
  Top 0.406: K1.29 113.28,76.64 arc-45 113.27,76.65 112.03,77.88 112.06,80.51 arc45 112.02,80.56 111.48,81.11 111.48,82.34 arc45 111.47,82.36 109.14,84.69 arc45 109.14,84.69 105.76,88.07 103.17,88.07 arc45 103.15,88.07 102.97,87.89 101.18,87.89 arc-45 101.16,87.9 100.72,88.34 100.72,88.35 99.55,89.53 94.7,89.53 93.02,87.84 80.24,87.84 75.82,92.26 62.64,92.26 59.6,89.27 59.35,89.27 59.14,89.27 57.5,89.27 55.49,91.28 55.49,96.04 JP4.14
GPIO6
  Top 0.254: K1.31 115.04,76.64 arc-45 115.03,76.65 114.68,76.99 114.68,80.68 arc45 114.68,80.69 114.14,81.23 113.56,81.23 arc-45 113.54,81.24 113.29,81.5 113.29,82.22 arc-45 113.29,82.24 R22.1
GPIO7
  Top 0.813: JP5.13 108.23,79.22 K1.26
GPIO8
  Top 0.813: JP5.12 105.69,79.22 K1.24
GPIO9  (via drill 0.6 pad 0.41)
  Top 0.406: v94.52,87.53 93.76,87.53 93.31,87.08 79.91,87.08 75.41,91.43 62.9,91.38 59.47,88.02 57.69,88.02 57.39,88.02 56.14,88.02 56.2,88.03 54.61,88.03 50.6,91.97 50.6,95.92 JP4.12
  Bottom 0.406: K1.21 103.19,76.89 arc-45 103.19,76.91 104.44,78.26 104.44,86.13 arc45 104.49,86.09 104.21,86.37 100.19,86.37 arc-45 100.18,86.38 99.66,86.9 95.93,86.9 arc45 95.92,86.89 | 95.92,86.89 95.91,86.88 | 95.92,86.89 95.83,86.89 95.19,87.53 v94.52,87.53
GPIO10  (via drill 0.6 pad 0.41)
  Top 0.406: v94.42,86.14 78.82,86.14 78.42,86.54 78.42,87.42 76.2,89.64 76.17,89.64 75.12,90.69 63.24,90.69 59.7,87.14 52.25,87.14 47.89,91.5 47.89,96.32 JP4.11
  Bottom 0.406: K1.19 100.69,76.64 arc45 100.71,76.65 101.89,77.94 101.89,85.03 arc45 101.99,85.05 101.47,85.56 99.72,85.56 arc-45 99.71,85.57 99.23,86.04 96.06,86.04 arc-45 96.04,86.05 | 96.04,86.05 96.02,86.07 | 96.04,86.05 94.51,86.05 v94.42,86.14
GPIO11  (via drill 0.6 pad 0.41)  (1 unrouted)
  Top 0.406: K1.23 105.73,76.66 107,77.93 107,85.05 105.48,86.57 98.24,86.57 97.19,87.62 v97.19,88.22 | v97.07,91.04 95.03,91.04 92.66,88.67 80.6,88.67 76.2,93.07 62.42,93.07 60.85,91.5 57.71,91.5 57.6,91.61 v57.6,91.73 v57.61,91.73 | v54.03,91.73 52.98,92.79 JP4.13
  Bottom 0.406: v97.19,88.22 97.19,90.91 v97.07,91.04 | v57.61,91.73 v54.03,91.73
GPIO12
  Top 0.61: K1.32 116.45,82.14 R17.1
GPIO13  (via drill 0.6 pad 0.41)
  Top 0.406: v83.72,94.07 79.42,94.07 79.38,94.03 v79.06,94.04 | JP4.6 35.2,92.6 37.79,90.01 45.91,90.01 v46.4,89.52
  Bottom 0.406: K1.33 118.43,77 119.72,78.34 119.72,80 118.84,80.93 118.27,80.93 118.03,81.17 118.03,87.14 117.79,87.38 117.79,93.48 115.98,95.29 96.18,95.29 94.26,93.37 89.68,93.37 88.99,94.06 83.73,94.06 v83.72,94.07 | v46.4,89.52 62.63,89.52 63.98,90.87 76.21,90.87 77.87,92.52 77.87,93.73 78.26,94.13 78.96,94.13 v79.06,94.04
GPIO16
  Top 0.61: K1.36 119.57,82.18 R18.1
GPIO17
  Top 0.406: K1.11 90.29,76.64 89.2,77.73 89.2,80.78 87.9,82.09 87.9,82.62 JP5.5
GPIO18  (via drill 0.6)
  Top 0.406: SJ1.1 86.88,74.05 v86.5,74.05
  Top 0.813: 90.45,79.22 K1.12
  Bottom 0.254: K1.12 89.16,77.86 89.16,75.7 87.77,74.31
  Bottom 0.406: v86.5,74.05 87.51,74.05 87.77,74.31
GPIO20
  Top 0.61: K1.38 122.75,82.1 R19.1
GPIO21
  Top 0.61: K1.40 125.75,82.02 R20.1
GPIO22
  Top 0.406: K1.15 95.37,76.64 arc-45 95.36,76.65 94.32,77.59 94.21,84.94 arc45 94.16,85.06 93.94,85.07 78.74,85.1 arc-45 78.62,85.15 77.58,86.17 77.54,87.18 74.79,89.92 63.61,89.96 59.8,86.2 37.76,86.21 arc-45 37.76,86.21 36.74,87.23 36.74,88.61 arc-45 36.75,88.63 | 36.75,88.63 36.77,88.65 | JP4.4 30.12,95.25 36.75,88.63
GPIO23
  Top 0.813: JP5.8 95.53,79.22 K1.16
GPIO24
  Top 0.813: JP5.9 98.07,79.22 K1.18
GPIO27
  Top 0.406: K1.13 93.03,76.97 91.74,78.25 91.74,79.99 90.56,81.17 90.56,82.52 JP5.6
GPIO28
  Top 0.813: JP5.11 103.15,79.22 K1.22
ID_SC  (via drill 0.6)
  Top 0.406: R1.1 99.34,68.23 100.59,69.48 105.8,69.48 v106.69,70.37 | v127.77,65.8 127.77,67.7 129.17,69.1 131.04,69.1 U1.6
  Bottom 0.254: K1.28 111.21,79.18 112.15,78.24 112.15,75.13
  Bottom 0.406: v106.69,70.37 106.69,71.51 109.48,74.31 111.64,74.31 112.15,75.13 126.25,75.13 127.39,73.04 127.39,66.18 v127.77,65.8
ID_SD  (via drill 0.6)
  Top 0.406: K1.27 v110.81,72.78 110.81,70.17 107.96,67.32 107.96,65.9 R2.1 | U1.5 129.69,67.84 129.42,67.58 129.42,63.5 128.04,62.12 115.45,62.12 114.75,61.42 105.23,61.42 v105.29,60.72
  Bottom 0.406: v105.29,60.72 105.29,66.94 107.83,69.48 107.83,71.26 108.09,71.51 109.54,71.51 v110.81,72.78
LED  (via drill 0.6 pad 0.41)
  Top 0.406: JP4.15 58.06,94.65 58.76,93.96 61.08,93.96 61.73,94.31 77.24,94.34 v79.13,92.45 | v65.27,88.62 65.27,86.96 R24.2
  Bottom 0.406: v79.13,92.45 79.13,92.24 77.53,90.63 77.53,90.58 76.07,89.12 65.77,89.12 v65.27,88.62
MCURESET1
  Top 0.406: R8.1 C9.1 91.01,58.6 90.29,57.88 90.29,47.68 89.24,46.63 87.74,46.63 87.29,47.08 85.69,47.08 IC2.1 82.75,47.8
  Top 0.61: 82.75,40.65 82.75,47.8
  Top 0.813: 79.62,37.52 79.62,32.1 JP1.1
  Top 1.016: 80.99,38.89 80.9,38.89 | 61.52,30.58 SW2.B' SW2.B 79.62,37.52 81.64,39.54
  Top 1.27: 80.99,38.89 81.64,39.54 82.75,40.65
N$1
  Top 0.61: 79.45,70.85 79.45,69.35
N$2
  Top 0.61: 83.1,70.85 83.1,69.35
N$3  (via drill 0.6)
  Top 0.406: R3.1 103.34,67.91 104.15,68.72 107.32,68.72 v108.98,70.37 | U1.7 132.61,70.39 132.98,70.75 132.98,72.21 132.47,72.72 120.53,72.72 120.66,72.53 120.66,71.42 CFG.1
  Bottom 0.406: v108.98,70.37 119.61,70.37 CFG.1
N$4
  Top 0.61: 87.1,70.85 87.1,69.35
N$5
  Top 1.016: R15.2 22.69,50.69 LED2.A
N$6
  Top 0.61: R16.2 22.13,56.57
  Top 1.016: 22.13,56.57 22.35,56.79 LED3.A
N$7
  Top 0.61: R17.2 115.95,86.69 113.78,88.86 112.28,88.86 LED1.A
N$8
  Top 0.61: R18.2 120.97,88.38 LED4.A
N$9
  Top 0.61: R19.2 123.54,87.18 125.36,89 132.58,89 LED5.A
N$10
  Top 0.61: R20.2 126.06,86.33 127.33,87.6 130.75,87.6 131.18,87.18 142.34,87.18 LED6.A
N$11
  Top 0.61: LED7.A 107,89.21 arc-45 107.02,89.2 109.02,87.19 109.02,87.19 arc45 109.03,87.17 110.97,85.23 113.16,85.23 arc-45 113.17,85.23 R22.2
PIRX  (via drill 0.6)
  Top 0.406: SJ3.1 83.07,72.91 v84.21,74.05
  Top 0.813: 87.91,79.22 K1.10
  Bottom 0.254: K1.10 86.62,77.86 86.62,75.7 85.35,74.43
  Bottom 0.406: v84.21,74.05 84.97,74.05 85.35,74.43
PITX  (via drill 0.6)  (1 unrouted)
  Top 0.406: SJ2.1 79.42,71.55 v81.93,74.05
  Bottom 0.254: 85.41,79.06 84.08,77.74 84.08,75.7 83,74.62 82.81,74.43
  Bottom 0.406: v81.93,74.05 82.43,74.05 83,74.62
RESET/ABORT  (via drill 0.6 pad 0.41)
  Top 0.406: 42.51,58.18 R14.2
  Top 0.813: RESET.2 45.5,12.07 31.79,25.78 31.79,57.43 34.04,59.68 43.49,59.68 44.62,58.56 | 44.62,58.56 v46.34,56.83 | 42.51,58.18 44.24,58.18 44.62,58.56
  Bottom 0.406: IC2.23 96.56,57.94 93.23,61.28 79.26,61.28 78.94,61.6 69.78,61.6 68.54,62.83 52.34,62.83 v46.34,56.83
RX
  Top 0.406: SJ2.2 79.39,53.16 81.04,51.32 85.86,51.32 86.37,50.81 86.37,48.94 IC2.2
SCL1  (via drill 0.6)
  Top 0.406: K1.5 82.87,76.39 79.26,72.78 77.99,72.78 77.73,72.53 77.73,59.58 78.24,59.07 78.24,54.87 78.2,54.97 78.06,54.98 77.75,55.13 v78.14,55.04 78.36,54.82 78.36,46.58 R5.1
  Top 1.27: DONGLE.4 72.37,53.95 73.47,55.06 74.52,55.06 v74.54,55.03 | v78.14,55.04 78.14,55.07 78.2,54.97
  Bottom 1.27: v74.54,55.03 78,55.03 v78.14,55.04
SDA1  (via drill 0.6)
  Top 0.61: v87.83,45.72 85.7,45.72 R4.1
  Top 1.27: K1.3 80.33,75.82 78.59,74.08 77.39,74.08 76.34,73.03 76.34,49.91 | 76.34,49.91 v76.34,48.89 | 76.34,49.91 68.07,49.91 65.09,46.93 65.13,41.78 64.37,40.82 57.47,40.82 56.58,41.8 56.54,53.07 57.44,53.97 59.69,53.97 DONGLE.3
  Bottom 0.61: v76.34,48.89 81.16,48.89 83.7,46.35 86.88,46.35 v87.83,45.72
SJ1
  Top 1.27: DONGLE.5 59.72,45.17 JP3.1
SJ2
  Top 1.27: DONGLE.6 62.26,45.04 JP2.1
SPINDLEDIR
  Top 1.016: IC2.19 106.72,58.26 108.79,60.32 125.3,60.32 126.88,58.74 126.88,35.24 126.57,34.92 126.57,32.07 125.3,30.8 119.9,30.8 119.26,30.16 119.26,29.85 117.99,28.57 104.34,28.57 101.48,25.72 101.48,19.69 98.94,17.14 76.7,17.14 70.19,10.63 63.59,10.63 SPINDLE.3
SPINDLEON
  Top 1.016: IC2.18 109.26,57.94 110.06,58.74 124.34,58.74 125.3,57.78 125.3,35.56 124.66,34.92 124.66,32.7 124.34,32.39 119.58,32.39 117.99,30.8 117.99,30.48 117.36,29.85 103.39,29.85 99.9,26.35 99.9,20.64 97.99,18.73 71.5,18.73 66.74,13.97 | R21.2 66.66,14.05 66.74,13.97 | 66.74,13.97 61.93,13.97 SPINDLE.2
START/RESUME  (via drill 0.6 pad 0.41)
  Top 0.813: v47.54,54.58 R13.2 | START.2 25.18,22.32 28.19,25.33 28.19,58.48 32.24,62.98 45.89,62.98 v47.99,60.73
  Bottom 0.406: IC2.24 94.02,57.63 91.32,60.32 79.26,60.32 78.62,60.76 69.36,60.76 68.14,62.08 52.99,62.08 47.54,56.83 v47.54,54.58
  Bottom 0.813: v47.99,60.73 44.54,57.28 44.54,54.73 44.69,54.58 v47.54,54.58
TX
  Top 0.406: R9.2 87.04,58.49 87.59,57.94 87.59,52.93 88.94,51.58 IC2.3
UIVCC  (via drill 0.6 pad 0.41)
  Top 0.813: DONGLE.1 59.72,57.91 61.15,59.34 61.15,63.24 SJ4.2 61.32,64.1 61.89,64.92 61.91,64.92 62.69,65.71 65.54,65.71 67.81,67.99 67.81,72.55 66.25,74.11 66.25,81.9 | 66.25,81.9 65.6,82.55 | 66.25,81.9 66.25,81.93 v65.61,82.57 | v70.88,82 72.73,82 72.99,82.26 72.99,83.73 C11.+
  Bottom 0.813: v65.61,82.57 70.31,82.57 v70.88,82
XDIR  (via drill 0.6)
  Top 1.016: v117.36,25.4 117.36,21.91 119.58,19.69 129.42,19.69 132.28,16.83 132.28,8.18 XDIR.2
  Bottom 1.016: v117.36,25.4 117.36,40.32 112.91,44.77 110.37,44.77 109.42,45.72 109.42,48.75 IC2.11
XLIMIT  (via drill 0.6)  (1 unrouted)
  Top 1.016: C4.2 126.57,21.91 v127.2,21.27 130.06,21.27 133.23,18.1 136.23,18.1 137.09,17.23 ZEND.1 | IC2.15 116.88,56.36 117.04,56.2 119.75,56.2
  Bottom 1.016: v127.2,21.27 124.34,21.27 123.71,21.91 123.71,56.83 122.76,57.78 117.36,57.78 117.04,57.47 117.04,56.69 IC2.15
XSTEP  (via drill 0.6)
  Top 1.016: v115.45,25.4 115.45,21.59 118.95,18.1 118.98,18.1 121.79,15.28 121.79,7.85 XPUL.2
  Bottom 1.016: v115.45,25.4 115.45,38.1 111.64,41.91 94.18,41.91 91.96,44.13 91.96,48.43 IC2.4
XTAL3
  Top 0.61: C6.2 106.57,41.6 | 106.57,41.6 106.57,48.76 IC2.10 | Q2.1 106.73,41.45 106.57,41.6
XTAL4
  Top 0.61: C7.2 102.43,41.6 | 102.43,41.6 102.43,47.15 IC2.9 | Q2.2 102.27,41.45 102.43,41.6
YDIR  (via drill 0.6)
  Top 1.016: v112.6,38.1 112.6,38.42 113.87,39.69 113.87,44.45 111.96,46.35 111.96,48.75 IC2.12 | v113.55,25.4 113.55,9.77 YDIR.2
  Bottom 1.016: v113.55,25.4 113.55,37.15 v112.6,38.1
YLIMIT  (via drill 0.6)
  Top 1.016: C5.2 125.3,25.4 v127.84,22.86 130.69,22.86 133.87,19.69 141.39,19.69 142.04,19.03 142.04,7.81 ZEND.2 | IC2.16 114.34,53.82 115.14,53.02 R6.1
  Bottom 1.016: v127.84,22.86 126.25,22.86 125.3,23.81 125.3,57.78 123.71,59.37 115.14,59.37 114.5,58.74 114.5,56.69 IC2.16
YSTEP  (via drill 0.6)
  Top 1.016: v111.64,25.4 111.64,19.37 101.41,9.13 YPUL.2 | v91.37,42.46 91.37,42.39 91.31,42.75 91.38,44.1 94.01,46.89 93.86,48.75 IC2.5
  Bottom 1.016: v111.64,25.4 111.64,36.2 110.69,37.15 96.72,37.15 92.91,40.96 v91.37,42.46
ZDIR  (via drill 0.6)
  Top 1.016: IC2.13 114.34,46.51 115.45,45.4 115.45,37.46 114.5,36.51 111.33,36.51 111.01,36.83 107.83,36.83 107.83,37.78 v108.79,38.74 | v96.72,39.69 96.72,33.65 v97.36,33.02
  Bottom 1.016: v108.79,38.74 97.67,38.74 v96.72,39.69 | 91.25,8.42 ZDIR.2 91.79,8.33 91.79,21.13 97.36,26.7 v97.36,33.02
ZLED3
  Top 1.016: XLED3.A R21.1
ZLIMIT  (via drill 0.6)  (1 unrouted)
  Top 1.016: C10.2 125.61,28.89 126.88,27.62 126.88,26.03 v128.47,24.45 131.33,24.45 134.5,21.27 145.35,21.27 147.29,19.33 147.29,7.97 ZEND.3 | IC2.17 111.8,52.55 112.91,51.43 117.84,51.43
  Bottom 1.016: v128.47,24.45 126.88,26.03 126.88,58.74 124.66,60.96 112.91,60.96 111.96,60.01 111.96,56.69 IC2.17
ZSTEP  (via drill 0.6)
  Top 1.016: IC2.6 96.71,47.67 92.74,43.7 92.69,40.55 92.06,39.92 91.01,39.85 90.67,39.52 90.67,38.97 90.65,38.21 90.65,37.24 | v90.04,37.24 90.65,37.24 | 90.65,37.24 90.04,37.23
  Bottom 1.016: v90.04,37.24 90.04,23.61 85.93,19.37 85.89,16.79 85.89,13.28 83.69,11.08 82.79,11.08 81.14,9.43 81.14,7.84 ZPUL.2

### Text on the board
Top: OpenHardware.co.za | GrblPi | Industrial Edition | B+ | 3-Axis CNC Controller
Bottom: HITEMP.CO.ZA
200bmp: Z:/Logos/logo.bmp
202bmp: Z:/Logos/logo.bmp
OHSILK: Chassis GND | BOOT | NETW | CNC | PROBLEM | RUN | CONTRAST | 10U | GP6 | GP12 | GP16 | GP20 | GP21 | GND | 10U | 220R | 5v | 3v3 | GND | GPIO4 | GPIO17 | GPIO27 | GND | GP23 | GP24 | GND | GP25 | GP8 | GP7 | 10U | + | OpenHardware.co.za | POWER IN / OUT | 10U | GrblPi | ID B+ | Industrial Edition | B+ | 5V | + | 3-Axis CNC Controller | ID | 22K | 10K | 6K8 | 3K9 | 3K9 | 0.1U | EEPROM | I2C VOLTAGE | 4N7 | 1K | 3.3V | 5V | GND | 10K | Wiring Instructions: wiki.openhardware.co.za | UI-DONGLE | 5V | 220R | 10K | 10K | 12V+ | 10U | 10K | 10K | 560R | 12V | 10K | PROG1 | PROG2 | 3K9 | 3K9 | 16Mhz | DC/DC CONVERTER | OUT+ | IN+ | 10U | + | 10U | 0.1U | 22P | 22P | RESET | 0.1u | 0.1u | Spindle | 1k | 0.1u | RESET | + | MIST | CONTROL | SPINDLE | LIMITS | GND | GND | START | GND | HOLD | GND | ABORT | ON | GND | ON | DIR | COOL | ENA | GND | GND | X | Y | Z | ZPUL | ZDIR | GND | YPUL | GND | YDIR | GND | XPUL | GND | XDIR